# Altium project pcie2displayport.PrjPCB
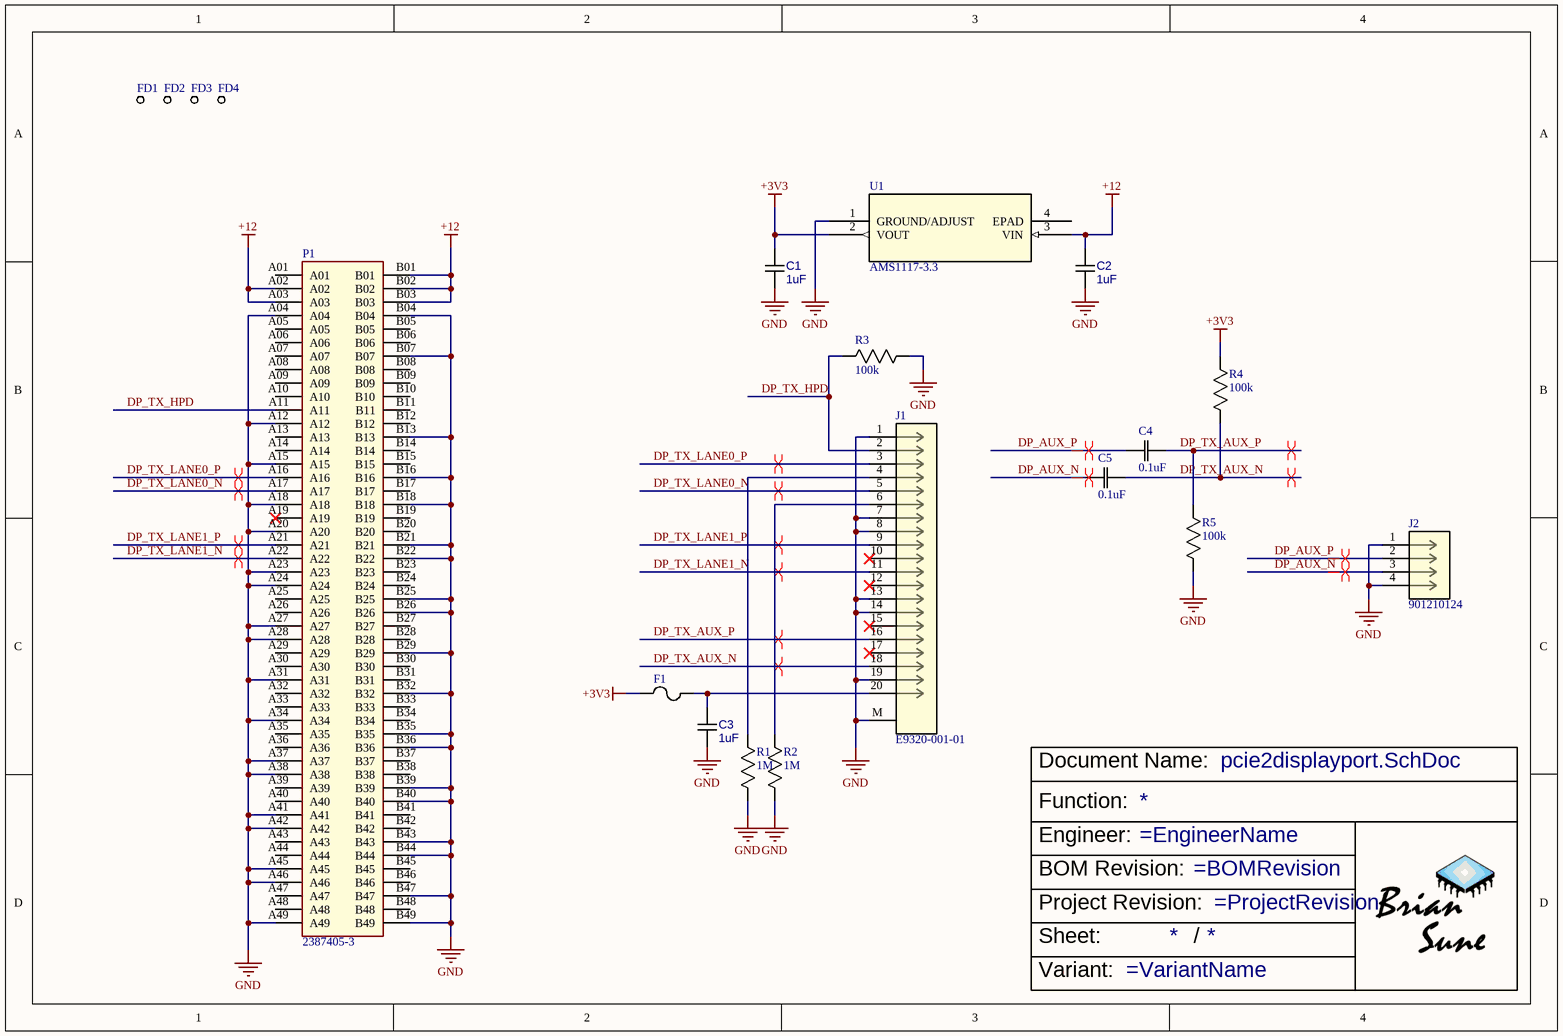
[diagram p0: pcie2displayport.SchDoc]
1 sheet, 20 parts. Net scope: global (net labels, ports and power ports of the same name join across sheets).
Board file: pcie2displayport.PcbDoc

## Sheet pcie2displayport.SchDoc
size A4

### Parts
?  TitleBlock  (value not drawn)  (graphical)
C1  1uF  [*CAPC1608X90]
C2  1uF  [*CAPC1608X90]
C3  1uF  [*CAPC1608X90]
C4  0.1uF  [CAP_CC0402_YAG]
C5  0.1uF  [CAP_CC0402_YAG]
F1  (no value)  [0435Series_LTF]
FD1  fiducial  [FD12D]  (value not drawn)
FD2  fiducial  [FD12D]  (value not drawn)
FD3  fiducial  [FD12D]  (value not drawn)
FD4  fiducial  [FD12D]  (value not drawn)
J1  E9320-001-01  [CONN_E9320-001-01_PUL]
J2  901210124  [CON_901210124]
P1  2387405-3  [PCIEG4,SMT,STRADDLE,98POS,G/F,O/E]
R1  1M  [0402_PAN]
R2  1M  [0402_PAN]
R3  100k  [0402_PAN]
R4  100k  [0402_PAN]
R5  100k  [0402_PAN]
U1  AMS1117-3.3  [SOT_AMS_ADS]

### Nets
+3V3: C1.1 F1.1 R4.2 U1.2(VOUT)
+12: C2.1 P1.A02 P1.A03 P1.B01 P1.B02 P1.B03 U1.3(VIN)
GND: C1.2 C2.2 C3.2 J1.1 J1.7 J1.8 J1.13 J1.14 J1.19 J1.M J2.1 J2.4 P1.A04 P1.A12 P1.A15 P1.A18 P1.A20 P1.A23 P1.A24 P1.A27 P1.A28 P1.A31 P1.A34 P1.A37 P1.A38 P1.A41 P1.A42 P1.A45 P1.A46 P1.A49 P1.B04 P1.B07 P1.B13 P1.B16 P1.B18 P1.B21 P1.B22 P1.B25 P1.B26 P1.B29 P1.B32 P1.B35 P1.B36 P1.B39 P1.B40 P1.B43 P1.B44 P1.B47 P1.B49 R1.1 R2.1 R3.1 R5.1 U1.1(GROUND/ADJUST)
DP_AUX_N: C5.2 J2.3
DP_AUX_P: C4.2 J2.2
DP_TX_AUX_N: C5.1 J1.18 R4.1
DP_TX_AUX_P: C4.1 J1.16 R5.2
DP_TX_HPD: J1.2 P1.A11 R3.2
DP_TX_LANE0_N: J1.5 P1.A17
DP_TX_LANE0_P: J1.3 P1.A16
DP_TX_LANE1_N: J1.11 P1.A22
DP_TX_LANE1_P: J1.9 P1.A21
NetC3_1: C3.1 F1.2 J1.20
NetJ1_4: J1.4 R1.2
NetJ1_6: J1.6 R2.2

Not connected (* = marked no-connect by the designer): J1 10* 12* 15* 17*; P1 A01 A05 A06 A07 A08 A09 A10 A13 A14 A19* A25 A26 A29 A30 A32 A33 A35 A36 A39 A40 A43 A44 A47 A48 B05 B06 B08 B09 B10 B11 B12 B14 B15 B17 B19 B20 B23 B24 B27 B28 B30 B31 B33 B34 B37 B38 B41 B42 B45 B46 B48; U1 4(EPAD)

### Layout directives
differential pair; differential pair class DP_DIFF: DP_TX_AUX_N, DP_TX_AUX_P, DP_TX_LANE0_N, DP_TX_LANE0_P, DP_TX_LANE1_N, DP_TX_LANE1_P
differential pair; differential pair class DP_DIFF_F: DP_AUX_N, DP_AUX_P

### Notes on the sheet
- (in symbol TitleBlock) Document Name:; Function:; Engineer:; BOM Revision:; Project Revision:; Sheet:; /; Variant:

### Library data of the parts
C1-C3 = 0603F105M500NT: 1uF(105) ±20% 50V X7R 0603F105M500NT; MP: C0603C104Z3VACTU; MF: KEMET; Package: 0603 Kemet; Price: None; Value: *; ComponentLink1Description: Taobao; ComponentLink1URL: https://item.taobao.com/item.htm?spm=a1z09.2.0.0.1e6b2e8dpr7A02&id=560896377413&_u=o10quk0k0a55
C4 C5 = CC0402MRX5R6BB106: No Description Available; Mfr_Name: Yageo; Type: DEV; Copyright: Copyright (C) 2022 Ultra Librarian. All rights reserved.; Manufacturer_Part_Number: CC0402MRX5R6BB106; RefDes: RefDes
F1 = 0402L100SLKR: No Description Available; Mfr_Name: Littelfuse Inc; Type: DEV; Copyright: Copyright (C) 2021 Ultra Librarian. All rights reserved.; Manufacturer_Part_Number: 0402L100SLKR; RefDes: RefDes
J1 = E9320-001-01: No Description Available; Mfr_Name: Pulse Electronics Corporation; Copyright: Copyright (C) 2022 Ultra Librarian. All rights reserved.; Manufacturer_Part_Number: E9320-001-01; RefDes: RefDes; Type: DEV
J2 = 901210124: No Description Available; Mfr_Name: Molex Connector Corporation; Copyright: Copyright (C) 2021 Ultra Librarian. All rights reserved.; Manufacturer_Part_Number: 901210124; RefDes: RefDes; Type: DEV
P1 = PCIE-098-02-X-D-EMS2-BG: PCIEG4,SMT,STRADDLE,98POS,G/F,O/E; MF: Samtec Inc.; Price: None; Availability: Unavailable; Value: *; MP: PCIE-098-02-X-D-EMS2-BG; Package: None
R1-R5 = ERJ2RHD2400X: 0402 1% Resistor; Vendor: Panasonic; Built_By: EMA_UL_Team; SourceLibrary: Panasonic_2016-11-1; Manufacturer_Part_Number: ERJ2RHD2400X; Copyright: Copyright (C) 2018 Accelerated Designs. All rights reserved; RefDes: RefDes; Type: DEV
U1 = AMS1117-3.3: No Description Available; Vendor: Advanced Monolithic Systems; Built_By: EMA_Matt; SourceLibrary: Advanced_Monolithic_Systems_10-16-2019; Copyright: Copyright (C) 2018 Accelerated Designs. All rights reserved; Manufacturer_Part_Number: AMS1117-3.3; RefDes: RefDes; Type: DEV
? = TitleBlock: Function: *